# Altium schematic sheet USB.SchDoc
size A; SheetNumber: 3; SheetTotal: 6
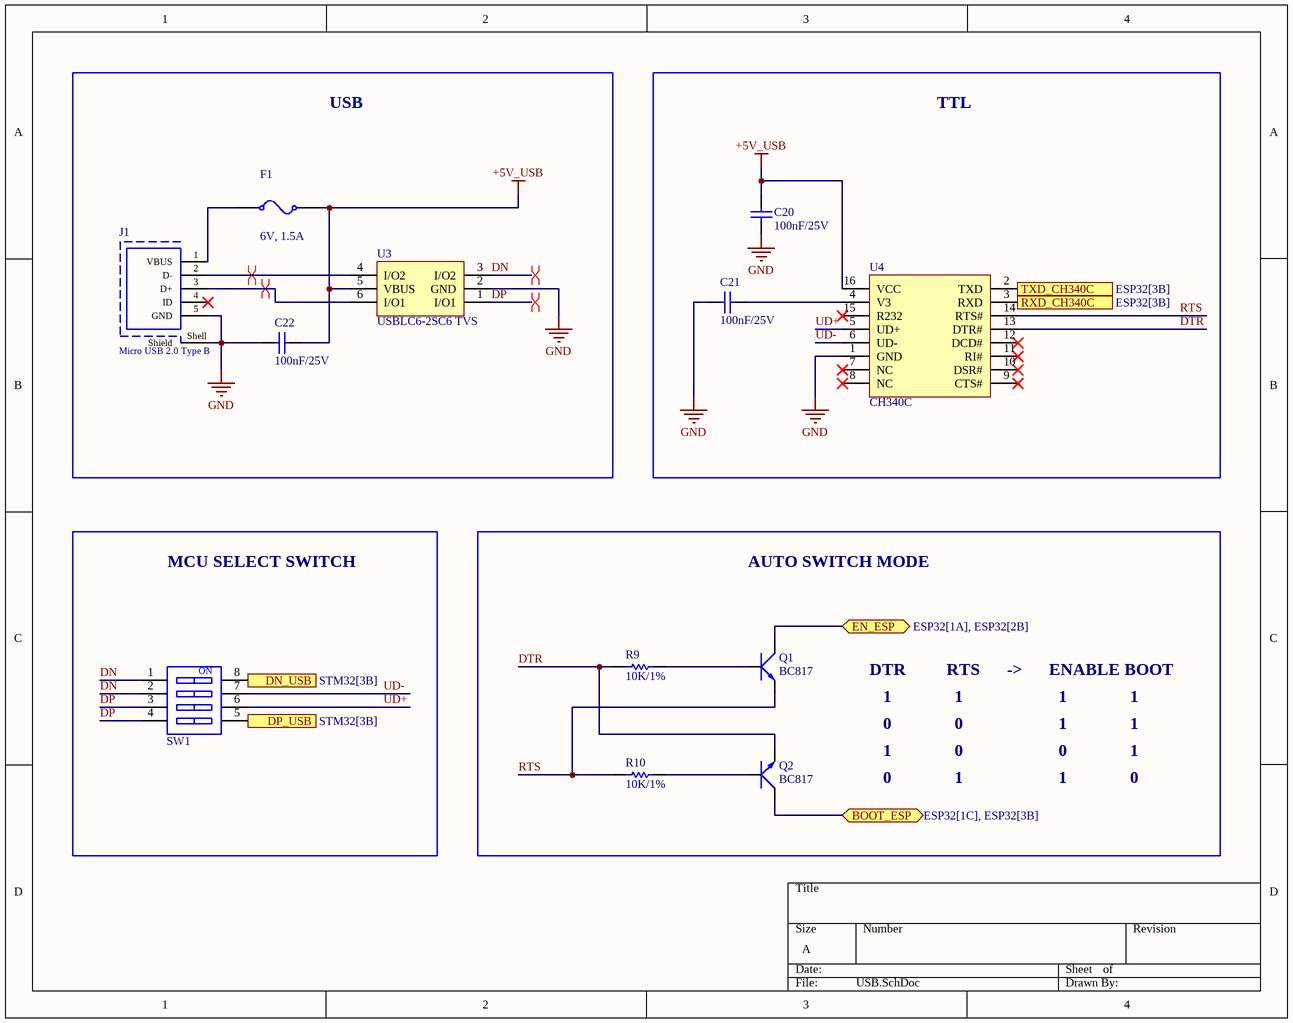
[diagram p0: USB.SchDoc]

## Parts
C20  value 100nF/25V  [CAP-SM-0805]  (hidden comment: Cap Non-Pol SMD)
C21  value 100nF/25V  [CAP-SM-0805]  (hidden comment: Cap Non-Pol SMD)
C22  value 100nF/25V  [CAP-SM-0805]  (hidden comment: Cap Non-Pol SMD)
F1  6V, 1.5A  [Fuse_SMD_1812]
J1  Micro USB 2.0 Type B  [629105150521]
Q1  BC817  [SOT-23]
Q2  BC817  [SOT-23]
R9  value 10K/1%  [RES-SM-0805]  (hidden comment: RESISTOR SMD)
R10  value 10K/1%  [RES-SM-0805]  (hidden comment: RESISTOR SMD)
SW1  418117270904  [418117270904]  (value not drawn)
U3  USBLC6-2SC6 TVS  [SOT23-6]
U4  CH340C  [SOIC16_50_284_25X90_SMT]

## Blocks framed on the sheet
USB: C22 F1 J1 U3
MCU SELECT SWITCH: SW1

## Ports
BOOT_ESP (bidir, see ESP32[1C], ESP32[3B]), DN_USB (out, see STM32[3B]), DP_USB (out, see STM32[3B]), EN_ESP (bidir, see ESP32[1A], ESP32[2B]), RXD_CH340C (in, see ESP32[3B]), TXD_CH340C (out, see ESP32[3B])

## Nets
+5V_USB: C20.1 C22.2 F1.1 U3.5(VBUS) U4.16(VCC)
GND: C20.2 C21.2 C22.1 J1.5(GND) J1.Shell(Shield) U3.2(GND) U4.1(GND)
BOOT_ESP: Q2.3(C) ; port BOOT_ESP
DN: SW1.1 SW1.2 U3.3(I/O2)
DN_USB: SW1.8 ; port DN_USB
DP: SW1.3 SW1.4 U3.1(I/O1)
DP_USB: SW1.5 ; port DP_USB
DTR: Q2.2(E) R9.1 U4.13(DTR#)
EN_ESP: Q1.3(C) ; port EN_ESP
RTS: Q1.2(E) R10.1 U4.14(RTS#)
RXD_CH340C: U4.3(RXD) ; port RXD_CH340C
TXD_CH340C: U4.2(TXD) ; port TXD_CH340C
UD+: SW1.6 U4.5(UD+)
UD-: SW1.7 U4.6(UD-)
NetC21_1: C21.1 U4.4(V3)
NetF1_0: F1.0 J1.1(VBUS)
NetJ1_2: J1.2(D-) U3.4(I/O2)
NetJ1_3: J1.3(D+) U3.6(I/O1)
NetQ1_1: Q1.1(B) R9.2
NetQ2_1: Q2.1(B) R10.2

Not connected (* = marked no-connect by the designer): J1 4(ID)*; U4 7(NC)* 8(NC)* 9(CTS#)* 10(DSR#)* 11(RI#)* 12(DCD#)* 15(R232)*

## Layout directives
differential pair: DN, DP, NetJ1_2, NetJ1_3

## Notes on the sheet
- TTL
- AUTO SWITCH MODE
- DTR         RTS      ->      ENABLE BOOT
- 1              1
- 0              0
- 1              0
- 0              1
- (in symbol 418117270904) ON

## Library data of the parts
C20-C22 = Cap Non-Pol SMD: Capacitor
F1 = 061812150024: Resettable Fuse, Size 1812, 24V, 1.5A; Manufacturer: Littelfuse; Threshold Current: 20A; Trip Current: 3A; Threshold Voltage: 24V; Hold Current: 1.5A; Size: 1812; Mounting Technology: SMT/SMD; ComponentLink1Description: Datasheet link; ComponentLink1URL: https://www.littelfuse.com/~/media/electronics/product_specifications/resettable_ptcs/littelfuse_ptc_minismdc300f_2_product_specification.pdf.pdf; ComponentLink2Description: Supplier 1 URL; ComponentLink2URL: https://www.mouser.vn/ProductDetail/Littelfuse/MINISMDC150F-24-2?qs=F6FIpiMdEVZ%2Fp37J%2FDHAxA%3D%3D; ComponentLink3Description: Supplier 2 URL; ComponentLink3URL: https://www.digikey.com/en/products/detail/littelfuse-inc/MINISMDC150F-24-2/1113513?s=N4IgTCBcDaILIEkByCDKcAiBhAjAVgAYAxAejABYBaCAXQF8g; ComponentLink4Description: Supplier 3 URL; ComponentLink4URL: https://www.thegioiic.com/cau-chi-tu-phuc-hoi-1812-24v-1-5a; Supplier 1 Name: Mouser; Supplier 1 SN: 650-MINISMDC150F/24; Supplier 1 URL: https://www.mouser.vn/ProductDetail/Littelfuse/MINISMDC150F-24-2?qs=F6FIpiMdEVZ%2Fp37J%2FDHAxA%3D%3D; Supplier 2 Name: Digi-Key; Supplier 2 SN: MINISMDC150F24-2TR-ND; Supplier 2 URL: https://www.mouser.vn/ProductDetail/Littelfuse/MINISMDC150F-24-2?qs=F6FIpiMdEVZ%2Fp37J%2FDHAxA%3D%3D; Supplier 3 Name: thegioiic; Supplier 3 SN: N/A; Supplier 3 URL: https://www.thegioiic.com/cau-chi-tu-phuc-hoi-1812-24v-1-5a; Value: 24V, 1.5A
J1 = 629105150521: Micro USB 2.0 Type B Receptacle WR-COM, Horizontal, SMT, with Pegs, High Current at Pin 1 & Pin 5; Rated Current: 3 A; Contact Resistance: 30 mOhm; Working Voltage: 30 VAC; ComponentLink1Description: Datasheet; ComponentLink1URL: https://katalog.we-online.de/em/datasheet/629105150521.pdf; ComponentLink2Description: Supplier 1 URL; ComponentLink2URL: N/A; Part Number: 629105150521; Published Date: September 2018; Publisher: Wurth Elektronik; Orientation: Horizontal; Connector Type: Micro USB 2.0 Type B; Operating Temperature: -40 to 85 degC; Mounting Technology: SMT; Gender: Receptacle; Packaging: Tape and Reel; ComponentLink3Description: Supplier 2 URL; ComponentLink3URL: N/A; ComponentLink4Description: Supplier 3 URL; ComponentLink4URL: N/A; Supplier 1 Name: Mouser; Supplier 1 SN: 710-629105150521; Supplier 1 URL: https://www.mouser.vn/ProductDetail/Wurth-Elektronik/629105150521?qs=a9WhcLg8qCzXiH7kZP8GRQ%3D%3D; Supplier 2 Name: Digi-Key; Supplier 2 SN: N/A; Supplier 2 URL: N/A; Supplier 3 Name: thegioiic; Supplier 3 SN: N/A; Supplier 3 URL: N/A; Value: Micro USB 2.0 Type B
Q1 Q2 = Trans BC817: SOT-23 - C8658; Value: C9014
R9 R10 = RESISTOR SMD: Resistor
SW1 = 418117270904: WS-DITV Compact THT Dip Switch, Raised Actuator, pitch 2.54mm, 4p; Manufacturer: Wurth Elektronik; Actuator Type: Raise Type; Operation Force: 800g; Rated Current Non-Switching: 100mA; Rated Current Switching: 25mA; Rated Voltage Non-Switching: 50VDC; Rated Voltage Switching: 24VDC; Number of Poles: 4; ComponentLink2Description: Datasheet Link; ComponentLink2URL: https://www.we-online.com/redexpert/spec/418117270904?ad; Manufacturer Part Number: 418117270904; Category: Dip Switches; Match Code: WS-DITV; Mount: Through Hole; Operating Temperature Max: 85°C; Operating Temperature Min: -40°C; Packaging: Tube; Contact Material: Copper Alloy; Contact Plating: Gold; Pitch: 2.54mm; Supplier 1 Name: Mouser; Supplier 1 SN: 710-418117270904; Supplier 1 URL: https://www.mouser.com/ProductDetail/Wurth-Elektronik/418117270904?qs=wr8lucFkNMUW2I6n2hVTKw%3D%3D; Supplier 2 Name: Digi-Key; Supplier 2 SN: 732-3834-5-ND; Supplier 2 URL: https://www.digikey.com/en/products/detail/w%C3%BCrth-elektronik/418117270904/3174489; Supplier 3 Name: Thegioiic; Supplier 3 SN: N/A; Supplier 3 URL: https://www.thegioiic.com/cong-tac-4-bit-dip-switch-xuyen-lo-2-54mm-mau-do
U3 = IC_LTC6992IS6-1: Oscillator, Silicon IC 3.81Hz ~ 1MHz TSOT-23-6; Manufacturer: Linear Technology/Analog Devices; Alternate Part Number-1: NA; Manufacturer Part Number: LTC6992IS6-1; Case/Package: SOT-23-6; Supplier-1: Arrow; Supplier Part Number-1: LTC6992IS6-1#TRMPBF
U4 = CH340C: USB Bridge, USB to UART USB 2.0 UART Interface; Manufacturer: Olimex; Alternate Part Number-1: NA; Manufacturer Part Number: CH340C; Case/Package: SOIC16; Supplier-1: LCSC; Supplier Part Number-1: C84681